# Altium schematic sheet top_level.SchDoc
size A
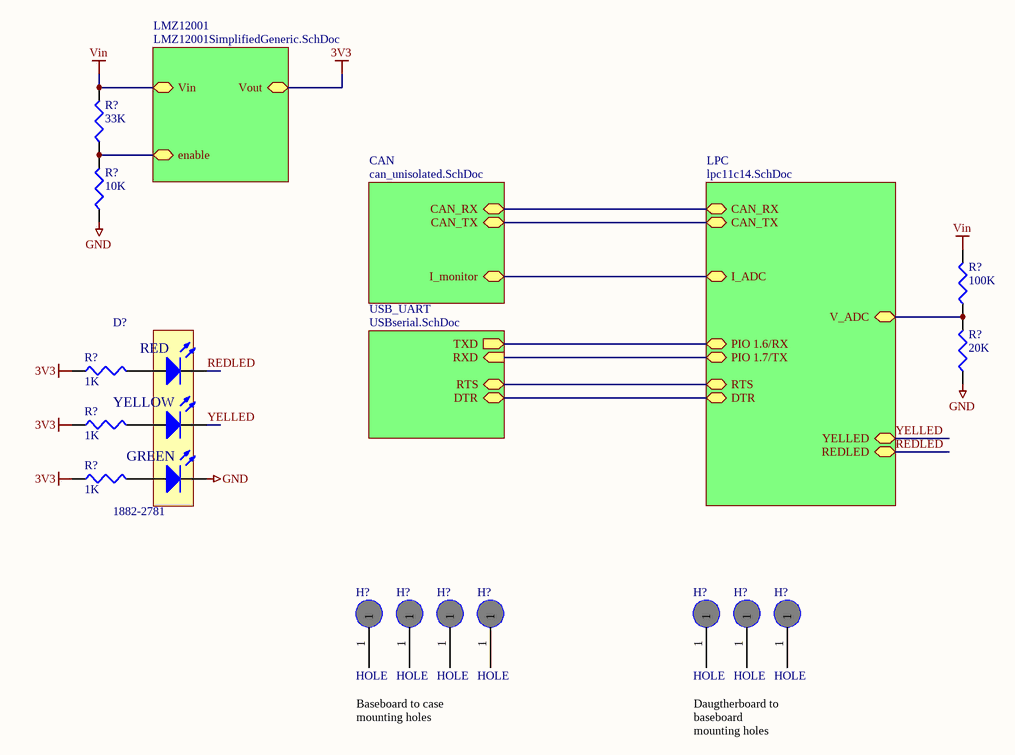
[diagram p0: top_level.SchDoc]

## Parts
(Parts that share a designator on the sheet are numbered #1, #2 ... from top to bottom, then left to right.)
D?  1882-2781  [LED_TRILEVEL]
H?#1  HOLE  [M2.5]
H?#2  HOLE  [M2.5]
H?#3  HOLE  [M2.5]
H?#4  HOLE  [M2.5]
H?#5  HOLE  [M2.5]
H?#6  HOLE  [M2.5]
H?#7  HOLE  [M2.5]
R?#1  33K  [0603]
R?#2  10K  [0603]
R?#3  100K  [0603]
R?#4  1K  [0603]
R?#5  20K  [0603]
R?#6  1K  [0603]
R?#7  1K  [0603]

## Sub-sheets
CAN = can_unisolated.SchDoc: CAN_RX (bidir), CAN_TX (bidir), I_monitor
LMZ12001 = LMZ12001SimplifiedGeneric.SchDoc: Vin, Vout, enable
LPC = lpc11c14.SchDoc: CAN_RX (bidir), CAN_TX (bidir), YELLED (bidir), REDLED (bidir), PIO 1.7/TX, PIO 1.6/RX, V_ADC, RTS, DTR, I_ADC
USB_UART = USBserial.SchDoc: TXD (out), RXD (in), RTS, DTR

## Nets
3V3: R?#4.1 R?#6.1 R?#7.1 ; sheet LMZ12001/Vout
GND: D?.1(K) R?#2.1 R?#5.1
Vin: R?#1.2 R?#3.2 ; sheet LMZ12001/Vin
REDLED: D?.3(K) ; sheet LPC/REDLED
YELLED: D?.2(K) ; sheet LPC/YELLED
NetD?_4: D?.4(A) R?#4.2
NetD?_5: D?.5(A) R?#6.2
NetD?_6: D?.6(A) R?#7.2
NetR?#1_1: R?#1.1 R?#2.2 ; sheet LMZ12001/enable
NetR?#3_1: R?#3.1 R?#5.2 ; sheet LPC/V_ADC
(unnamed): sheet LPC/CAN_RX, sheet CAN/CAN_RX
(unnamed): sheet LPC/CAN_TX, sheet CAN/CAN_TX
(unnamed): sheet LPC/PIO 1.7/TX, sheet USB_UART/RXD
(unnamed): sheet LPC/PIO 1.6/RX, sheet USB_UART/TXD
(unnamed): sheet LPC/RTS, sheet USB_UART/RTS
(unnamed): sheet LPC/DTR, sheet USB_UART/DTR
(unnamed): sheet LPC/I_ADC, sheet CAN/I_monitor

Not connected (* = marked no-connect by the designer): H?#1 1; H?#2 1; H?#3 1; H?#4 1; H?#5 1; H?#6 1; H?#7 1

## Notes on the sheet
- Baseboard to case mounting holes
- Daugtherboard to baseboard mounting holes
- (in symbol LED-TRILEVEL) RED; YELLOW; GREEN

## Library data of the parts
D? = LED-TRILEVEL: Three level LED; Needed?: Farnell - Low Stock; Farnell: 1461596; Farnell Price: 4.56
H?#1-H?#7 = HOLE: Needed?: NO - Footprint
R?#1 R?#2 = RES1: Resistor; Value: 1k; Needed?: NO - HW LAB
R?#3-R?#7 = RES1: Resistor; Needed?: NO - HW LAB
  R?#3: Value: 100k
  R?#4 R?#6 R?#7: Value: 1k
  R?#5: Value: 20k